# Altium schematic sheet Viberation.SchDoc
size 209 x 148 mm
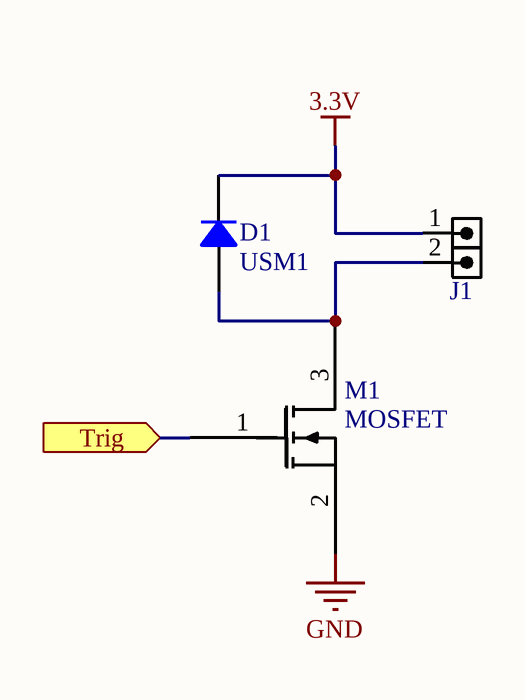
[diagram p0: Viberation.SchDoc]

## Parts
D1  USM1  [DO-214AC SMA]
J1  HDR2  [HDR1SE_M_1X2]  (value not drawn)
M1  MOSFET  [SOT-23]

## Ports
Trig (in)

## Nets
3.3V: D1.2 J1.1
GND: M1.2
Trig: M1.1 ; port Trig
NetD1_1: D1.1 J1.2 M1.3

## Library data of the parts
D1 = US1M (SMD SMA): Diode Standard 1000V 1A Surface Mount SMA; PartNumber: US1M-13-F
J1 = HDRTST_1X2: HEADER, 1mm pitch, test, SMD; VALUE: HDR2
M1 = 2N7002A